# EAGLE schematic pwr_brd_uni (EAGLE 9.0.0)
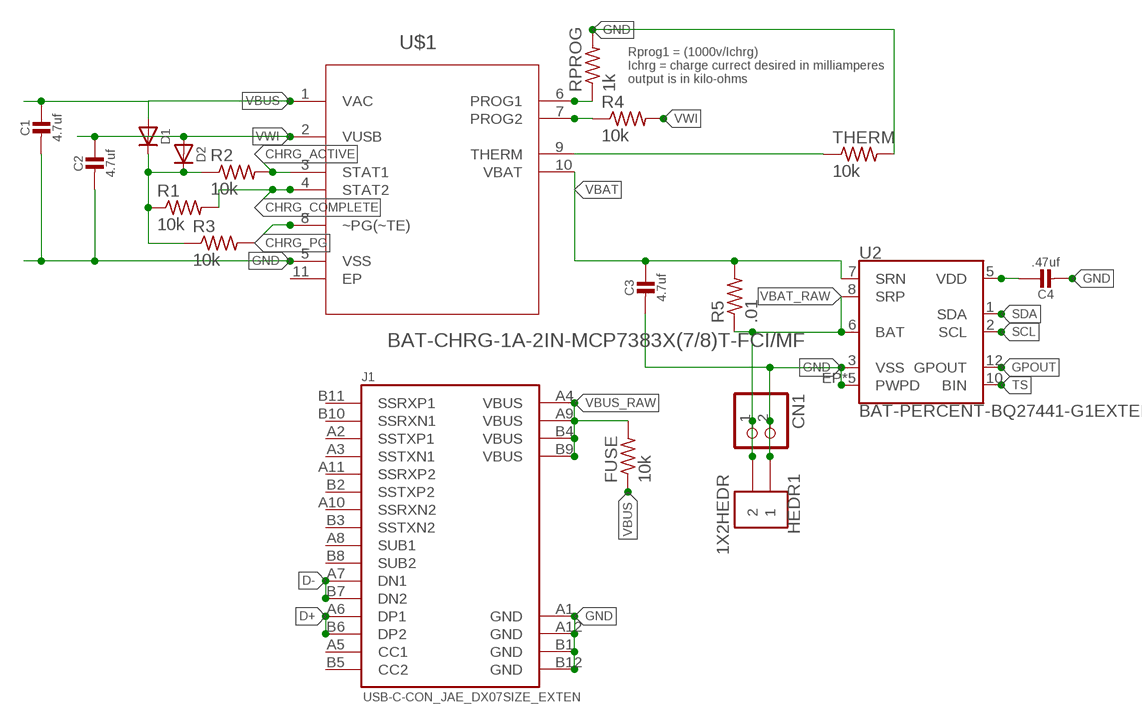
[diagram p0: schematic, sheet 1]

## Parts
C1  4.7uf  C-US__0805MP  [MICROBUILDER__0805MP]
C2  4.7uf  C-US__0805MP  [MICROBUILDER__0805MP]
C3  4.7uf  C-US__0805MP  [MICROBUILDER__0805MP]
C4  .47uf  C-US__0805MP  [MICROBUILDER__0805MP]
CN1  JST_2PIN-SMT-RA  [JST-PH-2-SMT-RA]
D1  DIODESOD-123  [SOD-123]
D2  DIODESOD-123  [SOD-123]
FUSE  10k  R-US_R0805  [R0805]
HEDR1  1X2HEDR  [1X2_HEDR]
J1  USB-C-CON_JAE_DX07SIZE_EXTEN  [JAE_DX07S024XJ1R1100_COMPLY_EXTEN]
R1  10k  R-US_R0805  [R0805]
R2  10k  R-US_R0805  [R0805]
R3  10k  R-US_R0805  [R0805]
R4  10k  R-US_R0805  [R0805]
R5  .01  R-US_R0805  [R0805]
RPROG  1k  R-US_R0805  [R0805]
THERM  10k  R-US_R0805  [R0805]
U2  BAT-PERCENT-BQ27441-G1EXTEN  [BAT_PMIC_PDSO-N12-EXTENDED]
U$1  BAT-CHRG-1A-2IN-MCP7383X(7/8)T-FCI/MF  [DFN300X300X100-11N]

## Nets
CHRG_ACTIVE: R2.2 U$1.3(STAT1)
CHRG_COMPLETE: R1.2 U$1.4(STAT2)
CHRG_PG: R3.2 U$1.8(~PG(~TE))
D+: J1.A6(DP1) J1.B6(DP2)
D-: J1.A7(DN1) J1.B7(DN2)
GND: C1.2 C2.2 C3.2 C4.2 CN1.2 HEDR1.1 J1.A1(GND) J1.A12(GND) J1.B1(GND) J1.B12(GND) RPROG.2 THERM.2 U2.3(VSS) U2.EP1(PWPD) U2.EP2(PWPD) U2.EP3(PWPD) U2.EP4(PWPD) U2.EP(PWPD) U$1.5(VSS)
GPOUT: U2.12(GPOUT)
N$6: C4.1 U2.5(VDD)
N$7: D1.C D2.C R1.1 R2.1 R3.1
N$8: THERM.1 U$1.9(THERM)
PROG1: RPROG.1 U$1.6(PROG1)
PROG2: R4.1 U$1.7(PROG2)
SCL: U2.2(SCL)
SDA: U2.1(SDA)
TS: U2.10(BIN)
VBAT: C3.1 R5.2 U2.7(SRN) U$1.10(VBAT)
VBAT_RAW: CN1.1 HEDR1.2 R5.1 U2.6(BAT) U2.8(SRP)
VBUS: C1.1 D1.A FUSE.1 U$1.1(VAC)
VBUS_RAW: FUSE.2 J1.A4(VBUS) J1.A9(VBUS) J1.B4(VBUS) J1.B9(VBUS)
VWI: C2.1 D2.A R4.2 U$1.2(VUSB)
Unconnected: J1.A2(SSTXP1) J1.A3(SSTXN1) J1.A5(CC1) J1.A8(SUB1) J1.A10(SSRXN2) J1.A11(SSRXP2) J1.B2(SSTXP2) J1.B3(SSTXN2) J1.B5(CC2) J1.B8(SUB2) J1.B10(SSRXN1) J1.B11(SSRXP1) U$1.11(EP)

## Notes on the sheet
- Rprog1 = (1000v/Ichrg)
  Ichrg = charge currect desired in milliamperes 
  output is in kilo-ohms

## Library data of the parts
C1-C4 = 0TG-Lib v01.3:C-US_: from: microbuilder Ceramic Capacitors For new designs, use the packages preceded by an '_' character since they are more reliable: The following footprints should be used on most boards: _0402 - Standard footprint for regular board layouts _0603 - Standard footprint for regular board layouts _0805 - Standard footprint for regular board layouts _1206 - Standard footprint for regular board layouts For extremely tight-pitch boards where space is at a premium, the following 'micro-pitch' footprints can be used (smaller pads, no silkscreen outline, etc.): _0402MP - Micro-pitch footprint for very dense/compact boards _0603MP - Micro-pitch footprint for very dense/compact boards _0805MP - Micro-pitch footprint for very dense/compact boards _1206MP - Micro-pitch footprint for very dense/compact boards
CN1 = 00adafruit:JST_2PIN: JST 2-Pin Connectors of various flavors SMT-RA (S2B-PH-SM4) 4UConnector #17311 SMT (B2B-PH-SM4) THM-RA (S2B-PH) THM (B2B-PH)
D1 D2 = 0TG-Lib v01.3:DIODE: Diode from: adafruit SMA Model Volts Amps Type Vf Ir Digikey # Notes SSA34-E3 40V 3A Schottky 480mV @ 3A 200uA @ 40V SSA34-E3/61TGITR-ND CDBA120-G 20V 1A Schottky 500mV @ 1A 500uA @ 20V 641-1014-6-ND REEL MBRA210 10V 2A Schottky 350mV @ 2A 700uA @ 10V MBRA210LT3 SOD-123 Model Volts Amps Type Vf Ir Order # Notes BAT54T1G 30V 200mA Schottky 800mV @ 200mA 2uA @ 25V BAT54T1GOSTR-ND B0530W 30V 500mA Schottky 430mV @ 500mA 130uA @ 30V B0530W-FDICT-ND REEL MBR120 20V 1A Schottky 340mV @ 1A MBR120VLSFT1GOSCT-ND SOD-323 Model Volts Amps Type Vf Ir Order # Notes PMEG2005EJ 20V 500mA Schottky 355mV @ 500mA 568-4110-1-ND ZLLS410 10V 570mA Schottky 380mV @ 570mA ZLLS410CT-ND 1N4148WS 75V 150mA Silicon/Simple 1V 1N4148WSFSCT-ND REEL SOD-523 Model Volts Amps Type Vf Ir Order # Notes BAT54XV2 30V 200mA Schottky 0.8V @ 100mA BAT54XV2CT-ND TB751S 30V 30mA Schottky RB751S-40TE61CT-ND SOT23-R/W (R = Solder Paste/Reflow Ovens, W = Hand-Soldering) Model Volts Amps Type Vf Ir Order # Notes BAT54FILM 40V 300mA Schottky 497-7162-1-ND POWERDI-5 Model Volts Amps Type Vf Ir Order # Notes PDS560 60V 5A Schottky 670mV @ 5A 150uA @ 60V PDS560DICT-ND
FUSE R1-R5 RPROG THERM = 0TG-Lib v01.3:R-US_: from: eaglecad RESISTOR, American symbol; SPICEPREFIX: R
HEDR1 = 0TG-Lib v01.3:1X2
J1 = 0TG-Lib v01.2:USB-C-CON_JAE_DX07: USB - C USB 3.1, Superspeed+ Receptacle Connector 24 Position Surface Mount, Right Angle; Through Hole from: snapeda
U2 = 0TG-Lib v01.3:BAT-PERCENT-BQ27441-G1: from: sparkfun
U$1 = 0TG-Lib v01.3:BAT-CHRG-1A-2IN-MCP7383X(7/8)T-FCI/MF: Battery Charge Management Controller; AVAILABILITY: Good; DESCRIPTION: MCP73837 Series 6 V Linear Battery Charge Controller Surface Mount - DFN-10; MF: Microchip; MP: MCP73837T-FCI/MF; PACKAGE: DFN-10 Microchip; PRICE: 0.99 USD